# Altium project Ku.PrjPCB
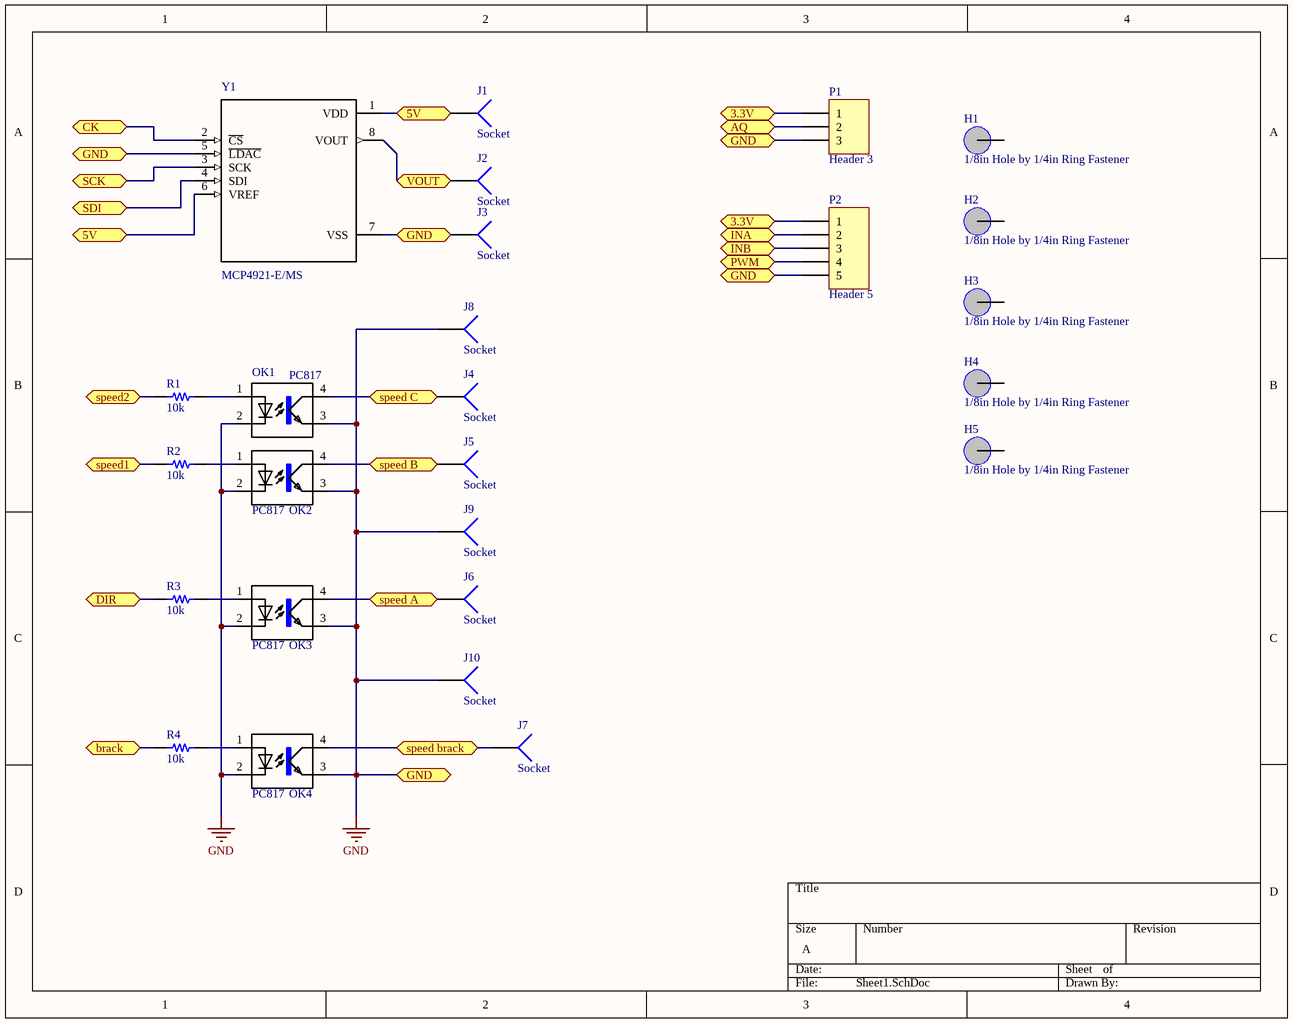
[diagram p0: Sheet1.SchDoc]
2 sheets, 27 parts. Net scope: flat (ports and power ports of the same name join across sheets).
Board file: PCB1.PcbDoc
Sheets:
  Sheet1.SchDoc
  GR.SchDoc

## Sheet Sheet1.SchDoc
size A

### Parts
H1  1/8in Hole by 1/4in Ring Fastener  [1/8in Fastener Hole]
H2  1/8in Hole by 1/4in Ring Fastener  [1/8in Fastener Hole]
H3  1/8in Hole by 1/4in Ring Fastener  [1/8in Fastener Hole]
H4  1/8in Hole by 1/4in Ring Fastener  [1/8in Fastener Hole]
H5  1/8in Hole by 1/4in Ring Fastener  [1/8in Fastener Hole]
J1  Socket  [PIN1]
J2  Socket  [PIN1]
J3  Socket  [PIN1]
J4  Socket  [PIN1]
J5  Socket  [PIN1]
J6  Socket  [PIN1]
J7  Socket  [PIN1]
J8  Socket  [PIN1]
J9  Socket  [PIN1]
J10  Socket  [PIN1]
OK1  PC817  [LITEON LTV-817]
OK2  PC817  [LITEON LTV-817]
OK3  PC817  [LITEON LTV-817]
OK4  PC817  [LITEON LTV-817]
P1  Header 3  [HDR1X3]
P2  Header 5  [HDR1X5]
R1  10k  [0805R-220]
R2  10k  [0805R-220]
R3  10k  [0805R-220]
R4  10k  [0805R-220]
Y1  MCP4921-E/MS  [SOIC127P600X175-8L]

### Ports
3.3V (bidir), 5V (bidir), AQ (bidir), brack (bidir), CK (bidir), DIR (bidir), GND (bidir), INA (bidir), INB (bidir), PWM (bidir), SCK (bidir), SDI (bidir), speed1 (bidir), speed2 (bidir), speed A (bidir), speed B (bidir), speed brack (bidir), speed C (bidir), VOUT (bidir)

### Nets
GND: J3.1 J8.1 J9.1 J10.1 OK1.2(C) OK1.3(EMIT) OK2.2(C) OK2.3(EMIT) OK3.2(C) OK3.3(EMIT) OK4.2(C) OK4.3(EMIT) P1.3 P2.5 Y1.5(~{LDAC}) Y1.7(VSS) ; port GND
NetJ1_1: J1.1 Y1.1(VDD) Y1.6(VREF) ; port 5V
NetJ2_1: J2.1 Y1.8(VOUT) ; port VOUT
NetJ4_1: J4.1 OK1.4(COL) ; port speed C
NetJ5_1: J5.1 OK2.4(COL) ; port speed B
NetJ6_1: J6.1 OK3.4(COL) ; port speed A
NetJ7_1: J7.1 OK4.4(COL) ; port speed brack
NetOK1_1: OK1.1(A) R1.1
NetOK2_1: OK2.1(A) R2.1
NetOK3_1: OK3.1(A) R3.1
NetOK4_1: OK4.1(A) R4.1
NetP1_1: P1.1 P2.1 ; port 3.3V
NetP1_2: P1.2 ; port AQ
NetP2_2: P2.2 ; port INA
NetP2_3: P2.3 ; port INB
NetP2_4: P2.4 ; port PWM
NetR1_2: R1.2 ; port speed2
NetR2_2: R2.2 ; port speed1
NetR3_2: R3.2 ; port DIR
NetR4_2: R4.2 ; port brack
NetU1_21: Y1.4(SDI) ; port SDI
NetU1_22: Y1.2(~{CS}) ; port CK
NetU1_28: Y1.3(SCK) ; port SCK

Not connected (* = marked no-connect by the designer): H1 1; H2 1; H3 1; H4 1; H5 1

### Library data of the parts
H1-H5 = 1/8in by 1/4in Fastner Hole
OK1-OK4 = PC817: Optocoupler DC-IN 1-CH Transistor DC-OUT 4-Pin PDIP Sleeve; MF: Sharp Microelectronics; Price: None; MP: PC817; Package: SMD-4 Sharp Microelectronics; SnapEDA_Link: https://www.snapeda.com/parts/PC817/Sharp%20Microelectronics/view-part/?ref=snap; Availability: Unavailable; Value: *
P1 = Header 3: Header, 3-Pin; LatestRevisionDate: 17-Jul-2002; LatestRevisionNote: Re-released for DXP Platform.; Publisher: Altium Limited
P2 = Header 5: Header, 5-Pin; LatestRevisionDate: 17-Jul-2002; LatestRevisionNote: Re-released for DXP Platform.; Publisher: Altium Limited
R1-R4 = Resistor: SMT Resistor; Value: 1K
Y1 = MCP4921-E/MS: MCP4921 Series 1 Ch 12-Bit Voltage Output Digital-to-Analog Converter-MSOP-8; MF: Microchip; Price: None; MP: MCP4921-E/MS; Package: MSOP-8 Microchip; SnapEDA_Link: https://www.snapeda.com/parts/MCP4921-E/MS/Microchip/view-part/?ref=snap; Availability: Unavailable; Value: *
J1-J10 = Socket: LatestRevisionDate: 17-Jul-2002; LatestRevisionNote: Re-released for DXP Platform.; Publisher: Altium Limited

## Sheet GR.SchDoc
size A
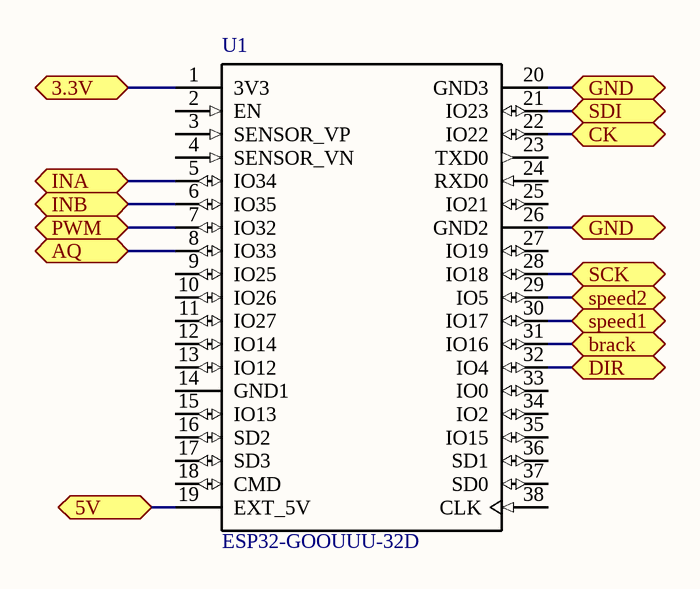
[diagram p1: GR.SchDoc]

### Parts
U1  ESP32-GOOUUU-32D  [ESP32-GOOUUU-32D]

### Ports
3.3V (bidir), 5V (bidir), AQ (bidir), brack (bidir), CK (bidir), DIR (bidir), GND (bidir), INA (bidir), INB (bidir), PWM (bidir), SCK (bidir), SDI (bidir), speed1 (bidir), speed2 (bidir)

### Nets
GND: U1.20(GND3) U1.26(GND2) ; port GND
NetJ1_1: U1.19(EXT_5V) ; port 5V
NetP1_1: U1.1(3V3) ; port 3.3V
NetP1_2: U1.8(IO33) ; port AQ
NetP2_2: U1.5(IO34) ; port INA
NetP2_3: U1.6(IO35) ; port INB
NetP2_4: U1.7(IO32) ; port PWM
NetR1_2: U1.29(IO5) ; port speed2
NetR2_2: U1.30(IO17) ; port speed1
NetR3_2: U1.32(IO4) ; port DIR
NetR4_2: U1.31(IO16) ; port brack
NetU1_21: U1.21(IO23) ; port SDI
NetU1_22: U1.22(IO22) ; port CK
NetU1_28: U1.28(IO18) ; port SCK

Not connected (* = marked no-connect by the designer): U1 2(EN) 3(SENSOR_VP) 4(SENSOR_VN) 9(IO25) 10(IO26) 11(IO27) 12(IO14) 13(IO12) 14(GND1) 15(IO13) 16(SD2) 17(SD3) 18(CMD) 23(TXD0) 24(RXD0) 25(IO21) 27(IO19) 33(IO0) 34(IO2) 35(IO15) 36(SD1) 37(SD0) 38(CLK)

### Library data of the parts
U1 = ESP32-GOOUUU-32D: Eval Board For Esp-Wroom-32; MP: ESP32-DEVKITC-32D; MF: Espressif Systems; Price: None; Availability: Unavailable; SnapEDA_Link: https://www.snapeda.com/parts/ESP32-DEVKITC-32D/Espressif%20Systems/view-part/?ref=snap; Package: None; Value: *

## Nets that join several sheets
GND: Sheet1 (16 pins), GR (U1.20 U1.26)
NetJ1_1: Sheet1 (J1.1 Y1.1 Y1.6), GR (U1.19)
NetP1_1: Sheet1 (P1.1 P2.1), GR (U1.1)
NetP1_2: Sheet1 (P1.2), GR (U1.8)
NetP2_2: Sheet1 (P2.2), GR (U1.5)
NetP2_3: Sheet1 (P2.3), GR (U1.6)
NetP2_4: Sheet1 (P2.4), GR (U1.7)
NetR1_2: Sheet1 (R1.2), GR (U1.29)
NetR2_2: Sheet1 (R2.2), GR (U1.30)
NetR3_2: Sheet1 (R3.2), GR (U1.32)
NetR4_2: Sheet1 (R4.2), GR (U1.31)
NetU1_21: Sheet1 (Y1.4), GR (U1.21)
NetU1_22: Sheet1 (Y1.2), GR (U1.22)
NetU1_28: Sheet1 (Y1.3), GR (U1.28)